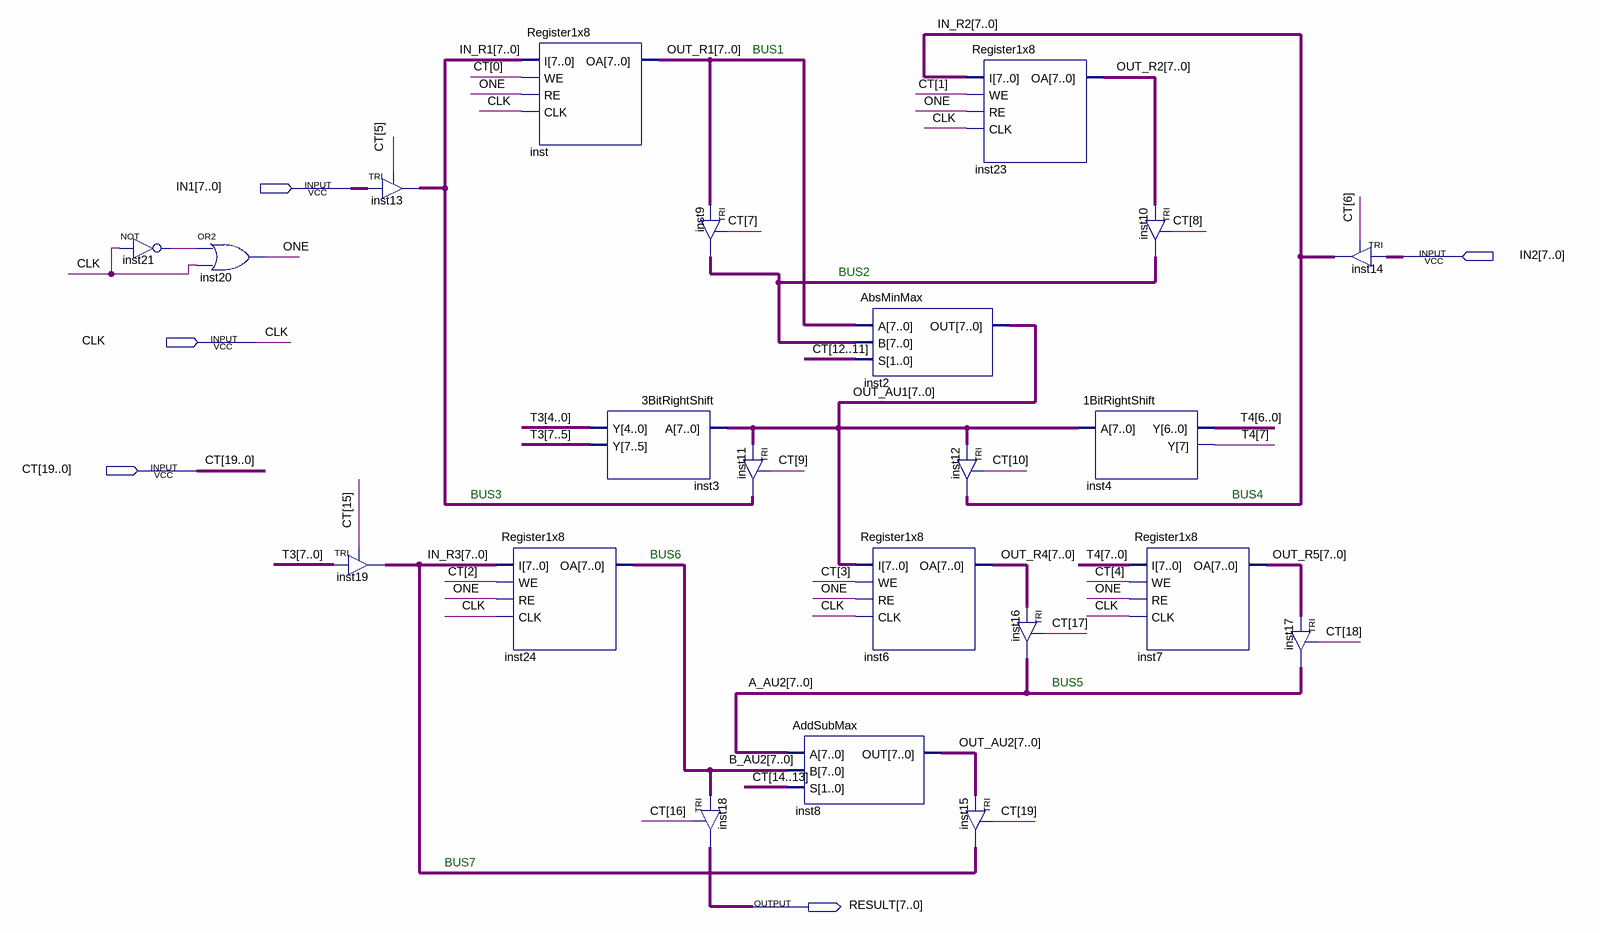
[diagram p0: schematic sheet]
// Quartus schematic Datapath2.bdf as structural Verilog: 22 symbols, 5 pins
module Datapath2 (
  input  [7:0] IN1,
  input  [7:0] IN2,
  input  CLK,
  input  [19:0] CT,
  output [7:0] RESULT
);

  wire inst21_out, ONE;
  wire [7:0] A_AU2, B_AU2, IN_R1, IN_R2, IN_R3, inst9_out, OUT_AU1, OUT_AU2, OUT_R1, OUT_R2, OUT_R4, OUT_R5,
       T3, T4;

  not inst21 (inst21_out, CLK);
  or inst20 (ONE, inst21_out, CLK);
  TRI inst19[7:0] (.IN(T3), .OE(CT[15]), .OUT(IN_R3));
  TRI inst13[7:0] (.IN(IN1), .OE(CT[5]), .OUT(IN_R1));
  Register1x8 inst (.I(IN_R1), .WE(CT[0]), .RE(ONE), .CLK(CLK), .OA(OUT_R1));
  Register1x8 inst24 (.I(IN_R3), .WE(CT[2]), .RE(ONE), .CLK(CLK), .OA(B_AU2));
  \3BitRightShift  inst3 (.A(OUT_AU1), .Y(T3));
  TRI inst9[7:0] (.IN(OUT_R1), .OE(CT[7]), .OUT(inst9_out));
  TRI inst18[7:0] (.IN(B_AU2), .OE(CT[16]), .OUT(RESULT));
  TRI inst11[7:0] (.IN(OUT_AU1), .OE(CT[9]), .OUT(IN_R1));
  AddSubMax inst8 (.A(A_AU2), .B(B_AU2), .S(CT[14:13]), .OUT(OUT_AU2));
  AbsMinMax inst2 (.A(OUT_R1), .B(inst9_out), .S(CT[12:11]), .OUT(OUT_AU1));
  Register1x8 inst6 (.I(OUT_AU1), .WE(CT[3]), .RE(ONE), .CLK(CLK), .OA(OUT_R4));
  Register1x8 inst23 (.I(IN_R2), .WE(CT[1]), .RE(ONE), .CLK(CLK), .OA(OUT_R2));
  TRI inst12[7:0] (.IN(OUT_AU1), .OE(CT[10]), .OUT(IN_R2));
  TRI inst15[7:0] (.IN(OUT_AU2), .OE(CT[19]), .OUT(IN_R3));
  TRI inst16[7:0] (.IN(OUT_R4), .OE(CT[17]), .OUT(A_AU2));
  \1BitRightShift  inst4 (.A(OUT_AU1), .Y(T4));
  TRI inst10[7:0] (.IN(OUT_R2), .OE(CT[8]), .OUT(inst9_out));
  Register1x8 inst7 (.I(T4), .WE(CT[4]), .RE(ONE), .CLK(CLK), .OA(OUT_R5));
  TRI inst17[7:0] (.IN(OUT_R5), .OE(CT[18]), .OUT(A_AU2));
  TRI inst14[7:0] (.IN(IN2), .OE(CT[6]), .OUT(IN_R2));

  // Notes on the sheet:
  //   BUS1    
  //   BUS2    
  //   BUS3      
  //   BUS4        
  //   BUS6      
  //   BUS5      
  //   BUS7         
endmodule
